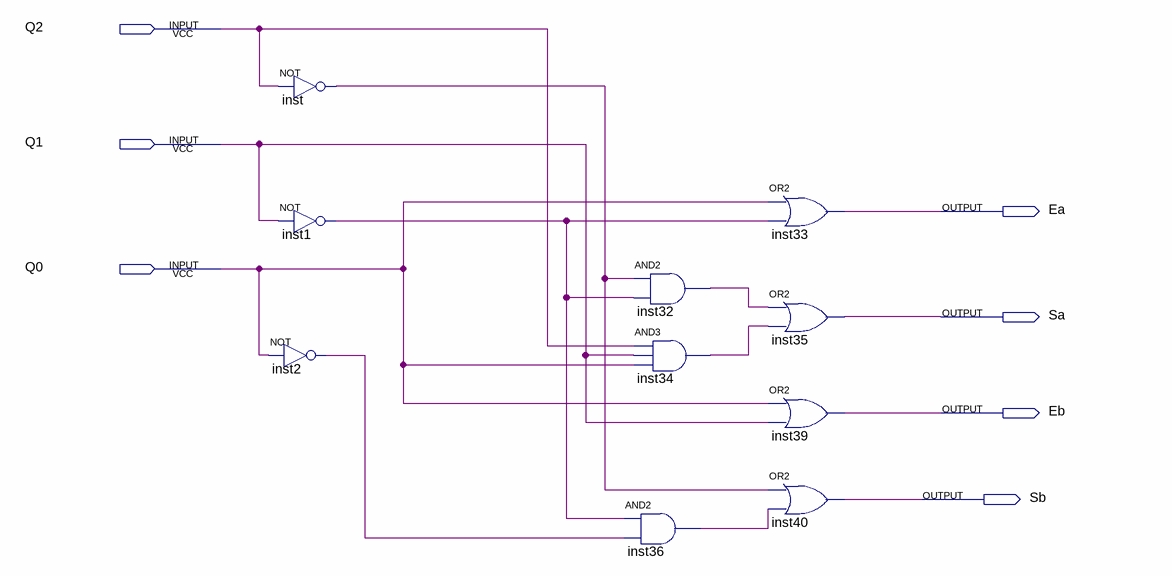
[diagram p0: schematic sheet]
// Quartus schematic salidas.bdf as structural Verilog: 10 symbols, 7 pins
module salidas (
  input  Q2,
  input  Q1,
  input  Q0,
  output Ea,
  output Sa,
  output Eb,
  output Sb
);

  wire inst1_out, inst2_out, inst32_out, inst34_out, inst36_out, inst_out;

  not inst2 (inst2_out, Q0);
  not inst (inst_out, Q2);
  not inst1 (inst1_out, Q1);
  and inst32 (inst32_out, inst_out, inst1_out);
  and inst34 (inst34_out, Q2, Q1, Q0);
  and inst36 (inst36_out, inst1_out, inst2_out);
  or inst33 (Ea, Q0, inst1_out);
  or inst35 (Sa, inst32_out, inst34_out);
  or inst39 (Eb, Q0, Q1);
  or inst40 (Sb, inst_out, inst36_out);
endmodule
